# Altium project TI_kbd_pcb.PrjPcb
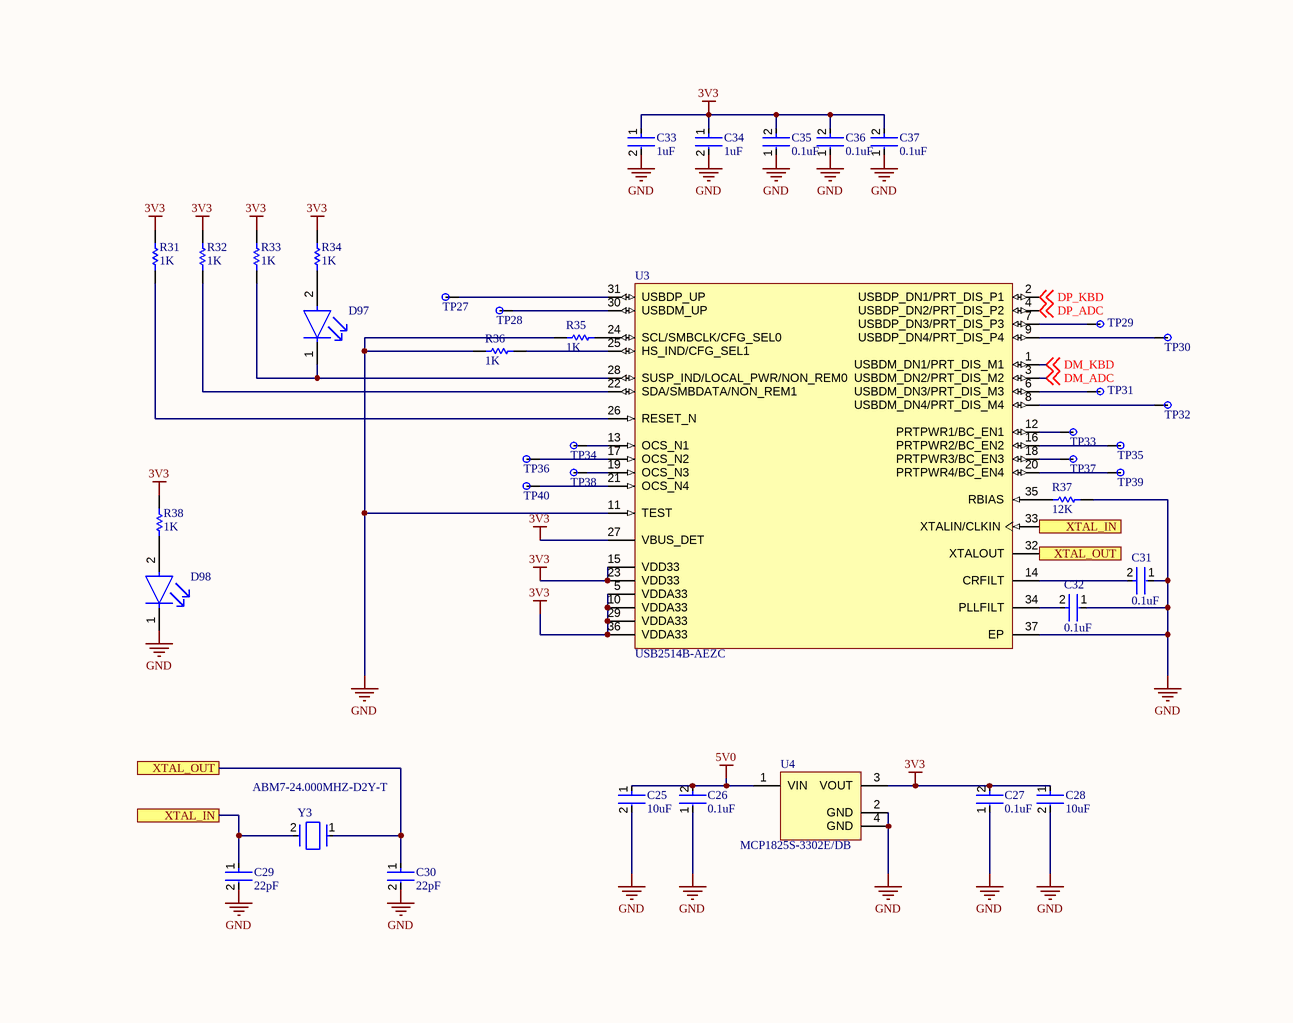
[diagram p0: TI_92_main.SchDoc]
4 sheets, 250 parts. Net scope: flat (ports and power ports of the same name join across sheets).
Board file: TI_kbd_pcb.PcbDoc
Sheets:
  TI_92_main.SchDoc
  TI_92_power.SchDoc
  TI_92_adc.SchDoc
  TI_92_kbd_ND.SchDoc

## Sheet TI_92_main.SchDoc: Keyboard
size A; Organization: Altium Limited; Address1: L3, 12a Rodborough Rd; Address2: Frenchs Forest; Address3: NSW; Address4: Australia 2086; SheetNumber: 1

### Parts
C25  10uF  [FP-0603-L_1_6_0_2-W_0_8_0-MFG]
C26  0.1uF  [FP-GRM15-MFG]
C27  0.1uF  [FP-GRM15-MFG]
C28  10uF  [FP-0603-L_1_6_0_2-W_0_8_0-MFG]
C29  22pF  [FP-0402-L_1_0_1-W_0_5_0_1-MFG]
C30  22pF  [FP-C0402C105K8PACTU-MFG]
C31  0.1uF  [FP-GRM15-MFG]
C32  0.1uF  [FP-GRM15-MFG]
C33  1uF  [FP-C0402C105K8PACTU-MFG]
C34  1uF  [FP-C0402C105K8PACTU-MFG]
C35  0.1uF  [FP-GRM15-MFG]
C36  0.1uF  [FP-GRM15-MFG]
C37  0.1uF  [FP-GRM15-MFG]
D97  APHHS1005CGCK  [FP-APHHS1005CGCK-MFG]  (value not drawn)
D98  APHHS1005CGCK  [FP-APHHS1005CGCK-MFG]  (value not drawn)
R31  1K  [RESC1005X40X25NL05T10]
R32  1K  [RESC1005X40X25NL05T10]
R33  1K  [RESC1005X40X25NL05T10]
R34  1K  [RESC1005X40X25NL05T10]
R35  1K  [RESC1005X40X25NL05T10]
R36  1K  [RESC1005X40X25NL05T10]
R37  12K  [RESC1005X40X25NL05T10]
R38  1K  [RESC1005X40X25NL05T10]
TP27  Test Pad  [2.5MM_PAD]  (value not drawn)
TP28  Test Pad  [2.5MM_PAD]  (value not drawn)
TP29  Test Pad  [2.5MM_PAD]  (value not drawn)
TP30  Test Pad  [2.5MM_PAD]  (value not drawn)
TP31  Test Pad  [2.5MM_PAD]  (value not drawn)
TP32  Test Pad  [2.5MM_PAD]  (value not drawn)
TP33  Test Pad  [1.0mm_Pad]  (value not drawn)
TP34  Test Pad  [1.0mm_Pad]  (value not drawn)
TP35  Test Pad  [1.0mm_Pad]  (value not drawn)
TP36  Test Pad  [1.0mm_Pad]  (value not drawn)
TP37  Test Pad  [1.0mm_Pad]  (value not drawn)
TP38  Test Pad  [1.0mm_Pad]  (value not drawn)
TP39  Test Pad  [1.0mm_Pad]  (value not drawn)
TP40  Test Pad  [1.0mm_Pad]  (value not drawn)
U3  USB2514B-AEZC  [MCHP-QFN-36_V]
U4  MCP1825S-3302E/DB  [SOT-223-DB3_N]
Y3  ABM7-24.000MHZ-D2Y-T  [FP-ABM7-MFG]

### Ports
XTAL_IN, XTAL_OUT

### Nets
3V3: C27.2 C28.1 C33.1 C34.1 C35.2 C36.2 C37.2 R31.2 R32.2 R33.2 R34.2 R38.2 U3.5(VDDA33) U3.10(VDDA33) U3.15(VDD33) U3.23(VDD33) U3.27(VBUS_DET) U3.29(VDDA33) U3.36(VDDA33) U4.3(VOUT)
5V0: C25.1 C26.2 U4.1(VIN)
GND: C25.2 C26.1 C27.1 C28.2 C29.2 C30.2 C31.1 C32.1 C33.2 C34.2 C35.1 C36.1 C37.1 D98.1(C) R35.2 R36.2 R37.2 U3.11(TEST) U3.37(EP) U4.2(GND) U4.4(GND)
DM_ADC: U3.3(USBDM_DN2/PRT_DIS_M2) ; off-sheet DM_ADC
DM_KBD: U3.1(USBDM_DN1/PRT_DIS_M1) ; off-sheet DM_KBD
DP_ADC: U3.4(USBDP_DN2/PRT_DIS_P2) ; off-sheet DP_ADC
DP_KBD: U3.2(USBDP_DN1/PRT_DIS_P1) ; off-sheet DP_KBD
NetC29_1: C29.1 U3.33(XTALIN/CLKIN) Y3.2 ; port XTAL_IN
NetC30_1: C30.1 U3.32(XTALOUT) Y3.1 ; port XTAL_OUT
NetC31_2: C31.2 U3.14(CRFILT)
NetC32_2: C32.2 U3.34(PLLFILT)
NetD97_1: D97.1(C) R33.1 U3.28(SUSP_IND/LOCAL_PWR/NON_REM0)
NetD97_2: D97.2(A) R34.1
NetD98_2: D98.2(A) R38.1
NetR31_1: R31.1 U3.26(RESET_N)
NetR32_1: R32.1 U3.22(SDA/SMBDATA/NON_REM1)
NetR35_1: R35.1 U3.24(SCL/SMBCLK/CFG_SEL0)
NetR36_1: R36.1 U3.25(HS_IND/CFG_SEL1)
NetR37_1: R37.1 U3.35(RBIAS)
NetTP27_1: TP27.1(PAD) U3.31(USBDP_UP)
NetTP28_1: TP28.1(PAD) U3.30(USBDM_UP)
NetTP29_1: TP29.1(PAD) U3.7(USBDP_DN3/PRT_DIS_P3)
NetTP30_1: TP30.1(PAD) U3.9(USBDP_DN4/PRT_DIS_P4)
NetTP31_1: TP31.1(PAD) U3.6(USBDM_DN3/PRT_DIS_M3)
NetTP32_1: TP32.1(PAD) U3.8(USBDM_DN4/PRT_DIS_M4)
NetTP33_1: TP33.1(PAD) U3.12(PRTPWR1/BC_EN1)
NetTP34_1: TP34.1(PAD) U3.13(OCS_N1)
NetTP35_1: TP35.1(PAD) U3.16(PRTPWR2/BC_EN2)
NetTP36_1: TP36.1(PAD) U3.17(OCS_N2)
NetTP37_1: TP37.1(PAD) U3.18(PRTPWR3/BC_EN3)
NetTP38_1: TP38.1(PAD) U3.19(OCS_N3)
NetTP39_1: TP39.1(PAD) U3.20(PRTPWR4/BC_EN4)
NetTP40_1: TP40.1(PAD) U3.21(OCS_N4)

### Notes on the sheet
- DWG. NO.
- REV.
- SHT.
- THIS DOCUMENT AND THE DATA DISCLOSED HEREIN OR HEREWITH IS THE PROPERTY OF ALTIUM LIMITED AND MAY BE FREELY DISTRIBUTED IN WHOLE. NO RIGHTS ARE RESERVED OR EXPRESS OR IMPLIED WARANTEE GIVEN.
- REVISION
- DESCRIPTION
- DATE
- APPROVED
- ENG:
- APPROVALS
- PROJECT
- DSN:
- CHK:
- REFERENCE DOCUMENTS
- PROJECT REVISION:
- TITLE
- DOCUMENT REVISION:
- DESIGN ITEM:
- BOM:
- FAB DWG:
- PCB DWG:
- ASSY DWG:
- SCALE:
- SIZE
- B
- CAGE CODE
- FILE NAME
- DWG NO.
- SHEET
- OF
- REV

### Library data of the parts
C25 C28 = CMP-14477-005164-2: Multilayer Ceramic Capacitor 10uF 25V X5R 20% SMD 0603 T/R; Capacitance: 10uF; Packaging: Tape and Reel; Tolerance: 20%; Mount: Surface Mount; Case Code (Metric): 1608; Case Code (Imperial): 0603; Min Operating Temperature: -55°C; Lead Free: Lead Free; RoHS Compliant: Yes; Case/Package: 0603; Max Operating Temperature: 85°C; Voltage Rating: 25V
C26 C27 C31 C32 C35-C37 = CMP-2100-03641-2: CAP CER 0.1UF 16V X7R 0402; Manufacturer Part Number: GRM155R71C104KA88D; Manufacturer: Murata; Standoff Height: 0mm; Tolerance: 10%; Voltage Rating: 16Vdc; Material: Ceramic; Capacitance: 0.10μF; Value: 0.10μF; RoHS: TRUE; Temperature Characteristic: X7R; Octopart: https://octopart.com/grm155r71c104ka88d-murata-196880; Digikey Description: CAP CER 0.1UF 16V X7R 0402; Device Class L3: Ceramic Capacitors; Height: 0.55mm; ComponentLink2Description: Datasheet; Temperature Range Low: -55°C; Ipc Land Pattern Name: CAPC10050X219; ComponentLink2URL: https://search.murata.co.jp/Ceramy/image/img/A01X/G101/ENG/GRM155R71H471KA01-01A.pdf; Device Class L1: Passive Components; Lead Free: yes; Category: Cap; Package: GRM15; Temperature: -55°C to +125°C; Device Class L2: Capacitors; Temperature Range High: +125°C; Mouser Description: 0402 0.1 uF 16V ±10 % Tolerance X7R SMT Multilayer Ceramic Capacitor
C29 = CMP-2008-02613-2: General Purpose Ceramic Capacitor, 0402, 22pF, 5%, C0G, 30ppm/°C, 50V; Temperature Coefficient: 30ppm/°C; Mount: Surface Mount; Length: 1mm; Construction: Flat; Contact Plating: Tin; REACH SVHC: No SVHC; Case/Package: 0402; Voltage: 50V; Case Code (Imperial): 0402; Thickness: 0.022inch; Radiation Hardening: No; Number of Pins: 2; Tolerance: 5%; Max Operating Temperature: 125°C; RoHS Compliant: Yes; Voltage Rating: 50V; Case Code (Metric): 1005; Package Quantity: 1; Width: 0.02inch; Termination: SMD/SMT; Lead Free: Lead Free; Height: 0.5mm; Voltage Rating (DC): 50V; Capacitance: 22pF; Min Operating Temperature: -55°C; Series: -; Depth: 0.5mm; Dielectric: C0G; Packaging: Tape and Reel
C30 C33 C34 = CMP-2008-02081-2: CAP CER 1UF 10V X5R 0402; Dielectric Material: Ceramic; Dissipation Factor: 5%; Tolerance: 10%; Number of Pins: 2; Contact Plating: Tin; Min Operating Temperature: -55°C; Termination: SMD/SMT; Lead Free: Lead Free; Construction: Flat; Voltage Rating (DC): 10V; Mount: Surface Mount; Series: C; Thickness: 0.022inch; Width: 0.5mm; Radiation Hardening: No; Capacitance: 1uF; Dielectric: X5R; Height: 0.5mm; Voltage: 10V; Length: 1mm; Depth: 0.5mm; Max Operating Temperature: 85°C; Package Quantity: 1; Packaging: Tape and Reel; RoHS Compliant: Yes; Case Code (Imperial): 0402; Case Code (Metric): 1005; REACH SVHC: No SVHC; Voltage Rating: 10V; Case/Package: 0402
D97 D98 = CMP-44529-000044-1: LED GREEN CLEAR CHIP SMD; Viewing Angle: 120°; Dominant Wavelength: 570nm; Test Current: 20mA; Luminous Intensity: 50mcd; Forward Voltage: 2.1V; Number of LEDs: 1; Lens Color: Clear; Packaging: Tape and Reel; Max Operating Temperature: 85°C; Illumination Color: Green; Length: 1mm; Mount: Surface Mount; Lens Style: Clear; Color: Green; Number of Pins: 2; Wavelength: 570nm; Case/Package: 0402; Width: 0.5mm; Package Quantity: 2000; Case Code (Metric): 1005; Height: 0.6mm; Lead Free: Lead Free; Case Code (Imperial): 0402; Forward Current: 20mA; Min Operating Temperature: -40°C
R31-R38 = CMP-2002-07472-1: Part Number: RC0402FR-071KL; Manufacturer: Yageo / Phycomp
TP27-TP40 = Test_Pad: Various Test Pads
U3 = CMP-2000-05217-1: USB 2.0 High-Speed Hub Controller, 4 Ports, 3 to 3.6 V, 0 to 85 degC, 36-Pin QFN, RoHS, Tray; Manufacturer: Microchip; Interface: I²CEEPROM,SMBus(2-Wire,I²C); Other Names: 638-1122; Voltage - Supply: 3V~3.6V; Current - Supply: 70mA; Manufacturer URL: http://www.microchip.com/; Packaging: Tray; Function: -; Standards: -; Category: IntegratedCircuits(ICs); Package / Case: 36-VFQFNExposedPad; Supplier Device Package: 36-QFN(6x6); Family: Interface-Controllers; Datasheet Version: DS00001692C, 10/2015; Standard Package: 490; Series: -; Protocol: -; Datasheet URL: http://ww1.microchip.com/downloads/en/DeviceDoc/00001692C.pdf; Operating Temperature: -
U4 = CMP-0136-00458-1: 500 mA, Low Voltage, Low Quiescent Current LDO Regulator, 3-Pin SOT-223, Extended Temperature; PackageReference: SOT-223-DB3; PackageDescription: 3-Lead Plastic Small Outline Transistor (DB) [SOT-223]; PackageVersion: revBB, Aug-2009; DatasheetVersion: revB, Feb-2008
Y3 = CMP-27762-000095-1: Crystal 16MHz ±20ppm 18pF SMD-2 6mm x 3.5mm; ESR (Equivalent Series Resistance): 50R; Frequency Stability: 30ppm; Width: 3.3mm; Frequency: 16MHz; Radiation Hardening: No; Height: 0.055inch; Tolerance: 20ppm; Length: 6mm; Case/Package: CSMD; Lead Free: Lead Free; Min Operating Temperature: -40°C; Termination: SMD/SMT; Operating Frequency: 16 MHz; Resistor Type: Ceramic; Packaging: Tape and Reel; Mount: Surface Mount; Load Capacitance: 18pF; Frequency Tolerance: 20ppm; Depth: 3.5mm; Series: ABM7; Package Quantity: 1000; Max Operating Temperature: 85°C; Number of Pins: 2

## Sheet TI_92_power.SchDoc: Power
size A; Organization: Altium Limited; Address1: L3, 12a Rodborough Rd; Address2: Frenchs Forest; Address3: NSW; Address4: Australia 2086; SheetNumber: 2
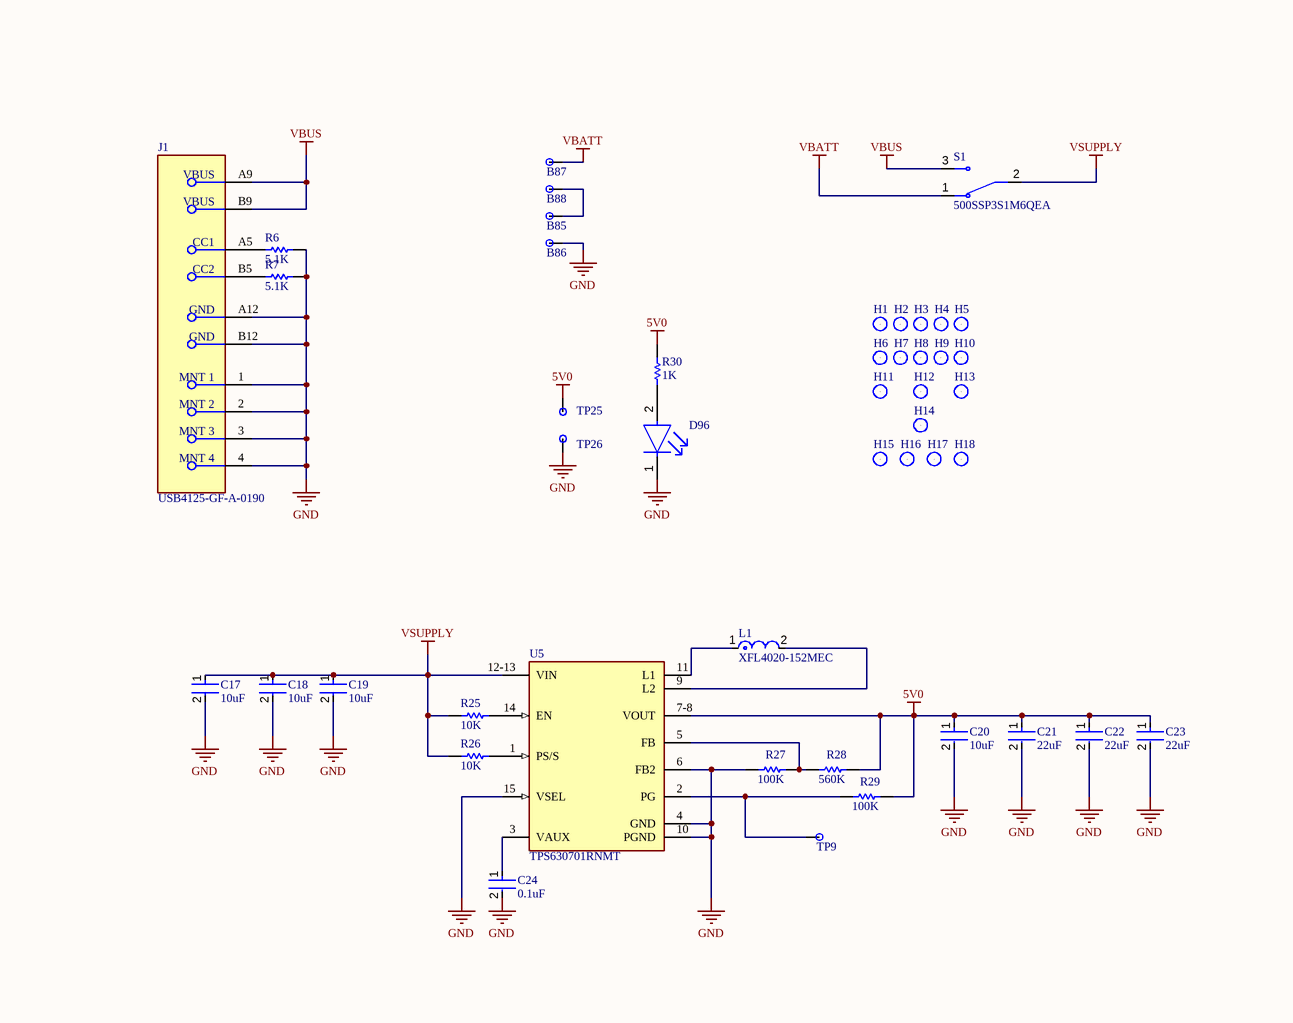
[diagram p1: TI_92_power.SchDoc]

### Parts
B85  Test Pad  [10mm_x_10mm_PAD]  (value not drawn)
B86  Test Pad  [10mm_x_8mm_PAD]  (value not drawn)
B87  Test Pad  [10mm_x_10mm_PAD]  (value not drawn)
B88  Test Pad  [10mm_x_8mm_PAD]  (value not drawn)
C17  10uF  [FP-GRM21B-0_2-e0_2_0_7-IPC_A]
C18  10uF  [FP-GRM21B-0_2-e0_2_0_7-IPC_A]
C19  10uF  [FP-0603-L_1_6_0_2-W_0_8_0-MFG]
C20  10uF  [FP-0603-L_1_6_0_2-W_0_8_0-MFG]
C21  22uF  [FP-GRM21B-0_2-e0_2_0_7-MFG]
C22  22uF  [FP-GRM21B-0_2-e0_2_0_7-MFG]
C23  22uF  [FP-GRM21B-0_2-e0_2_0_7-MFG]
C24  0.1uF  [FP-0402-L_1_0_0_05-W_0_5-IPC_B]
D96  APHHS1005CGCK  [FP-APHHS1005CGCK-MFG]  (value not drawn)
H1  Mounting Hole  [2.7mm_HOLE]  (value not drawn)
H2  Mounting Hole  [2.7mm_HOLE]  (value not drawn)
H3  Mounting Hole  [1.5mm_hole]  (value not drawn)
H4  Mounting Hole  [2.7mm_HOLE]  (value not drawn)
H5  Mounting Hole  [2.7mm_HOLE]  (value not drawn)
H6  Mounting Hole  [2.7mm_HOLE]  (value not drawn)
H7  Mounting Hole  [2.7mm_HOLE]  (value not drawn)
H8  Mounting Hole  [2.7mm_HOLE]  (value not drawn)
H9  Mounting Hole  [2.7mm_HOLE]  (value not drawn)
H10  Mounting Hole  [2.7mm_HOLE]  (value not drawn)
H11  Mounting Hole  [2.4mm_HOLE]  (value not drawn)
H12  Mounting Hole  [2.4mm_HOLE]  (value not drawn)
H13  Mounting Hole  [2.4mm_HOLE]  (value not drawn)
H14  Mounting Hole  [1.5mm_hole]  (value not drawn)
H15  Mounting Hole  [3.1mm_HOLE]  (value not drawn)
H16  Mounting Hole  [3.1mm_HOLE]  (value not drawn)
H17  Mounting Hole  [3.1mm_HOLE]  (value not drawn)
H18  Mounting Hole  [3.1mm_HOLE]  (value not drawn)
J1  USB4125-GF-A-0190  [FP-USB4125-GF-A-0190-MFG]
L1  XFL4020-152MEC  [FP-XFL4020-MFG]
R6  5.1K  [RESC1005X40X25NL05T10]
R7  5.1K  [RESC1005X40X25NL05T10]
R25  10K  [RESC1005X40X25NL05T10]
R26  10K  [RESC1005X40X25NL05T10]
R27  100K  [RESC1005X40X25NL05T10]
R28  560K  [RESC1005X40X25NL05T10]
R29  100K  [RESC1005X40X25NL05T10]
R30  1K  [RESC1005X40X25NL05T10]
S1  500SSP3S1M6QEA  [SW_500SSP3S1M6QEA]
TP9  Test Pad  [1.5MM_PAD]  (value not drawn)
TP25  Test Pad  [2.5MM_PAD]  (value not drawn)
TP26  Test Pad  [2.5MM_PAD]  (value not drawn)
U5  TPS630701RNMT  [FP-RNM0015A-MFG]

### Nets
5V0: C20.1 C21.1 C22.1 C23.1 R28.2 R29.2 R30.2 TP25.1(PAD) U5.7-8(VOUT)
GND: B86.1(PAD) C17.2 C18.2 C19.2 C20.2 C21.2 C22.2 C23.2 C24.2 D96.1(C) J1.1(MNT_1) J1.2(MNT_2) J1.3(MNT_3) J1.4(MNT_4) J1.A12(GND) J1.B12(GND) R6.1 R7.1 R27.1 TP26.1(PAD) U5.4(GND) U5.6(FB2) U5.10(PGND) U5.15(VSEL)
VBATT: B87.1(PAD) S1.1(NC)
VBUS: J1.A9(VBUS) J1.B9(VBUS) S1.3(NO)
VSUPPLY: C17.1 C18.1 C19.1 R25.2 R26.2 S1.2(COM) U5.12-13(VIN)
NetB85_1: B85.1(PAD) B88.1(PAD)
NetC24_1: C24.1 U5.3(VAUX)
NetD96_2: D96.2(A) R30.1
NetJ1_A5: J1.A5(CC1) R6.2
NetJ1_B5: J1.B5(CC2) R7.2
NetL1_1: L1.1 U5.11(L1)
NetL1_2: L1.2 U5.9(L2)
NetR25_1: R25.1 U5.14(EN)
NetR26_1: R26.1 U5.1(PS/S)
NetR27_2: R27.2 R28.1 U5.5(FB)
NetR29_1: R29.1 TP9.1(PAD) U5.2(PG)

Not connected (* = marked no-connect by the designer): H1 1(HOLE); H2 1(HOLE); H3 1(HOLE); H4 1(HOLE); H5 1(HOLE); H6 1(HOLE); H7 1(HOLE); H8 1(HOLE); H9 1(HOLE); H10 1(HOLE); H11 1(HOLE); H12 1(HOLE); H13 1(HOLE); H14 1(HOLE); H15 1(HOLE); H16 1(HOLE); H17 1(HOLE); H18 1(HOLE)

### Notes on the sheet
- DWG. NO.
- REV.
- SHT.
- THIS DOCUMENT AND THE DATA DISCLOSED HEREIN OR HEREWITH IS THE PROPERTY OF ALTIUM LIMITED AND MAY BE FREELY DISTRIBUTED IN WHOLE. NO RIGHTS ARE RESERVED OR EXPRESS OR IMPLIED WARANTEE GIVEN.
- REVISION
- DESCRIPTION
- DATE
- APPROVED
- ENG:
- APPROVALS
- PROJECT
- DSN:
- CHK:
- REFERENCE DOCUMENTS
- PROJECT REVISION:
- TITLE
- DOCUMENT REVISION:
- DESIGN ITEM:
- BOM:
- FAB DWG:
- PCB DWG:
- ASSY DWG:
- SCALE:
- SIZE
- B
- CAGE CODE
- FILE NAME
- DWG NO.
- SHEET
- OF
- REV

### Library data of the parts
B85-B88 TP9 TP25 TP26 = Test_Pad: Various Test Pads
C17 C18 = CMP-06035-056773-1: Chip Multilayer Ceramic Capacitors for General Purpose, 0805, 10uF, X7S, 22%, 20%, 25V; Case/Package: 0805; Min Operating Temperature: -55°C; Packaging: Tape and Reel; Height: 1.25mm; Thickness: 0.057inch; Weight: 0.000335oz; Termination: SMD/SMT; Capacitance: 10uF; Max Operating Temperature: 125°C; Length: 0.079inch; Dielectric: X7S; Mount: Surface Mount; Voltage Rating (DC): 25V; Case Code (Imperial): 0805; Case Code (Metric): 2012; Voltage Rating: 25V; Tolerance: 20%; Package Quantity: 3000; Width: 0.049inch
C19 C20 = CMP-14477-005164-2: as C25 on sheet TI_92_main; Capacitance: 10uF; Packaging: Tape and Reel; Tolerance: 20%; Mount: Surface Mount; Case Code (Metric): 1608; Case Code (Imperial): 0603; Min Operating Temperature: -55°C; Lead Free: Lead Free; RoHS Compliant: Yes; Case/Package: 0603; Max Operating Temperature: 85°C; Voltage Rating: 25V
C21-C23 = CMP-06035-012913-1: Chip Multilayer Ceramic Capacitors for General Purpose, 0805, 22uF, X6S, 22%, 20%, 16V; Packaging: Tape and Reel; Dielectric: X6S; Case Code (Imperial): 0805; Weight: 0.000335oz; Case Code (Metric): 2012; Thickness: 0.057inch; Min Operating Temperature: -55°C; Voltage Rating (DC): 16V; Tolerance: 20%; Width: 1.25mm; Voltage Rating: 16V; Mount: Surface Mount; Capacitance: 22uF; Length: 0.079inch; Lead Free: Lead Free; Case/Package: 0805; Package Quantity: 3000; Height: 1.25mm; Max Operating Temperature: 105°C; Termination: SMD/SMT
C24 = CMP-14477-003834-2: None; Capacitance: 100nF; Voltage Rating: 25V; Tolerance: 20%; Min Operating Temperature: -55°C; Max Operating Temperature: 125°C; Mount: Surface Mount; RoHS Compliant: Yes; Case/Package: 0402; Packaging: Tape and Reel
D96 = CMP-44529-000044-1: as D97 on sheet TI_92_main; Lens Color: Clear; Packaging: Tape and Reel; Max Operating Temperature: 85°C; Illumination Color: Green; Length: 1mm; Mount: Surface Mount; Lens Style: Clear; Color: Green; Number of Pins: 2; Wavelength: 570nm; Case/Package: 0402; Width: 0.5mm; Package Quantity: 2000; Case Code (Metric): 1005; Height: 0.6mm; Lead Free: Lead Free; Case Code (Imperial): 0402; Forward Current: 20mA; Min Operating Temperature: -40°C
H1-H18 = Mounting_Hole: Various Mounting Holes
J1 = CMP-245163-000004-1: CONN RCPT TYPE C 6P SMD RA
L1 = CMP-11268-000104-1: Inductor Power Shielded Wirewound 1.5uH 20% 100KHz 9.1A 15.8mOhm DCR 1515 Automotive Embossed Plastic T/R; Core Material: Composite; DC Resistance (DCR): 15.8mR; Saturation Current: 4.1A; Self Resonant Frequency: 59MHz; Tolerance: 20%; Inductance: 1.5uH; Max DC Current: 9.1A; RoHS Compliant: Yes; Max Operating Temperature: 125°C; Length: 4.3mm; Case/Package: SMD/SMT; Mount: Surface Mount; Shielding: Shielded; Min Operating Temperature: -40°C; RMS Current (Irms): 9.1A; Test Frequency: 100kHz; Inductance Tolerance: 20%; REACH SVHC: No SVHC; Packaging: Tape and Reel; Termination: SMD/SMT; Lead Free: Contains Lead; Width: 4.3mm; Series: XFL4020; Height: 2.1mm
R6 R7 R25-R30 = CMP-2002-07472-1: as R31 on sheet TI_92_main
U5 = CMP-04918-000497-1: IC REG BCK BST 5V 2A 15VQFN; Max Input Voltage: 16V; Switching Frequency: 2.4MHz; Min Input Voltage: 2V; Quiescent Current: 50uA; Topology: Buck-Boost; Output Current: 2A; Number of Pins: 15; Max Operating Temperature: 125°C; Packaging: Cut Tape; Nominal Output Voltage: 5V; REACH SVHC: No SVHC; RoHS Compliant: Yes; Lead Free: Lead Free
S1 = 500SSP3S1M6QEA: Price: None; MP: 500SSP3S1M6QEA; Availability: Unavailable; Value: *; Package: None

## Sheet TI_92_adc.SchDoc: Data_Input
size B; Organization: Altium Limited; Address1: L3, 12a Rodborough Rd; Address2: Frenchs Forest; Address3: NSW; Address4: Australia 2086; SheetNumber: 3
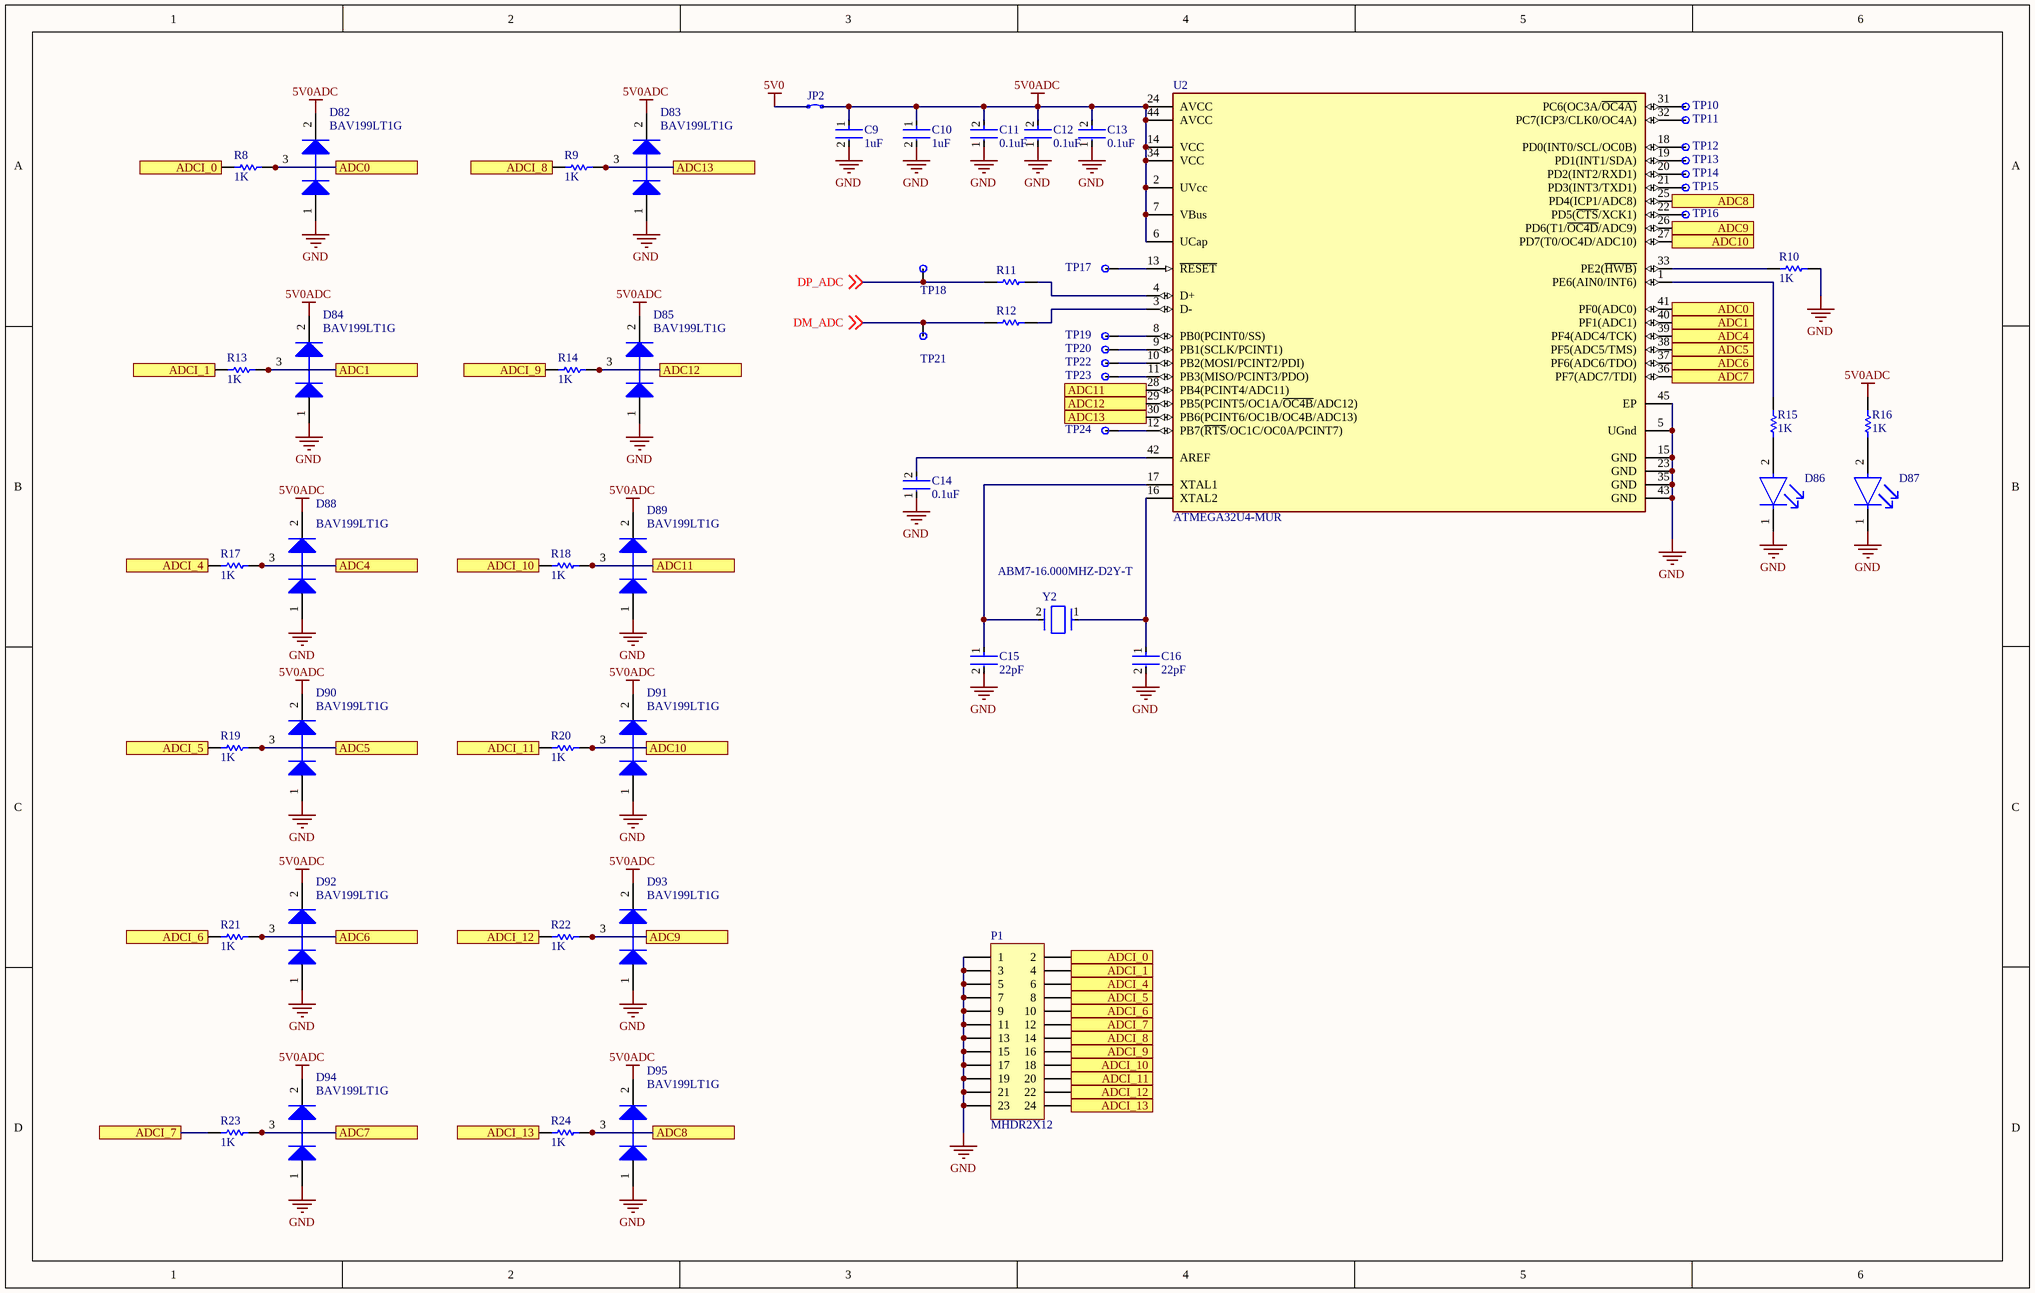
[diagram p2: TI_92_adc.SchDoc]

### Parts
C9  1uF  [FP-C0402C105K8PACTU-MFG]
C10  1uF  [FP-C0402C105K8PACTU-MFG]
C11  0.1uF  [FP-GRM15-MFG]
C12  0.1uF  [FP-GRM15-MFG]
C13  0.1uF  [FP-GRM15-MFG]
C14  0.1uF  [FP-GRM15-MFG]
C15  22pF  [FP-0402-L_1_0_1-W_0_5_0_1-MFG]
C16  22pF  [FP-C0402C105K8PACTU-MFG]
D82  BAV199LT1G  [ONSC-SOT-23-3-318-08_V]
D83  BAV199LT1G  [ONSC-SOT-23-3-318-08_V]
D84  BAV199LT1G  [ONSC-SOT-23-3-318-08_V]
D85  BAV199LT1G  [ONSC-SOT-23-3-318-08_V]
D86  APHHS1005CGCK  [FP-APHHS1005CGCK-MFG]  (value not drawn)
D87  APHHS1005CGCK  [FP-APHHS1005CGCK-MFG]  (value not drawn)
D88  BAV199LT1G  [ONSC-SOT-23-3-318-08_V]
D89  BAV199LT1G  [ONSC-SOT-23-3-318-08_V]
D90  BAV199LT1G  [ONSC-SOT-23-3-318-08_V]
D91  BAV199LT1G  [ONSC-SOT-23-3-318-08_V]
D92  BAV199LT1G  [ONSC-SOT-23-3-318-08_V]
D93  BAV199LT1G  [ONSC-SOT-23-3-318-08_V]
D94  BAV199LT1G  [ONSC-SOT-23-3-318-08_V]
D95  BAV199LT1G  [ONSC-SOT-23-3-318-08_V]
JP2  Solder Jumper  [SOLDER_JUMPER_CLOSED]  (value not drawn)
P1  MHDR2X12  [24_pin_Right_Angle_SMT_Header]
R8  1K  [RESC1005X40X25NL05T10]
R9  1K  [RESC1005X40X25NL05T10]
R10  1K  [RESC1005X40X25LL05T05]
R11  CRCW040222R0FKED  [RESC1005X40X25LL05T05]  (value not drawn)
R12  CRCW040222R0FKED  [RESC1005X40X25LL05T05]  (value not drawn)
R13  1K  [RESC1005X40X25NL05T10]
R14  1K  [RESC1005X40X25NL05T10]
R15  1K  [RESC1005X40X25NL05T10]
R16  1K  [RESC1005X40X25NL05T10]
R17  1K  [RESC1005X40X25NL05T10]
R18  1K  [RESC1005X40X25NL05T10]
R19  1K  [RESC1005X40X25NL05T10]
R20  1K  [RESC1005X40X25NL05T10]
R21  1K  [RESC1005X40X25NL05T10]
R22  1K  [RESC1005X40X25NL05T10]
R23  1K  [RESC1005X40X25NL05T10]
R24  1K  [RESC1005X40X25NL05T10]
TP10  Test Pad  [1.0mm_Pad]  (value not drawn)
TP11  Test Pad  [1.0mm_Pad]  (value not drawn)
TP12  Test Pad  [1.5MM_PAD]  (value not drawn)
TP13  Test Pad  [1.5MM_PAD]  (value not drawn)
TP14  Test Pad  [1.5MM_PAD]  (value not drawn)
TP15  Test Pad  [1.5MM_PAD]  (value not drawn)
TP16  Test Pad  [1.5MM_PAD]  (value not drawn)
TP17  Test Pad  [1.5MM_PAD]  (value not drawn)
TP18  Test Pad  [1.5MM_PAD]  (value not drawn)
TP19  Test Pad  [1.5MM_PAD]  (value not drawn)
TP20  Test Pad  [1.5MM_PAD]  (value not drawn)
TP21  Test Pad  [1.5MM_PAD]  (value not drawn)
TP22  Test Pad  [1.5MM_PAD]  (value not drawn)
TP23  Test Pad  [1.5MM_PAD]  (value not drawn)
TP24  Test Pad  [1.5MM_PAD]  (value not drawn)
U2  ATMEGA32U4-MUR  [FP-44PW-MFG]
Y2  ABM7-16.000MHZ-D2Y-T  [FP-ABM7-MFG]

### Ports
ADC0, ADC1, ADC4, ADC5, ADC6, ADC7, ADC8, ADC9, ADC10, ADC11, ADC12, ADC13, ADCI_0, ADCI_1, ADCI_4, ADCI_5, ADCI_6, ADCI_7, ADCI_8, ADCI_9, ADCI_10, ADCI_11, ADCI_12, ADCI_13

### Nets
5V0: JP2.1
5V0ADC: C9.1 C10.1 C11.2 C12.2 C13.2 D82.2(K) D83.2(K) D84.2(K) D85.2(K) D88.2(K) D89.2(K) D90.2(K) D91.2(K) D92.2(K) D93.2(K) D94.2(K) D95.2(K) JP2.2 R16.2 U2.2(UVcc) U2.6(UCap) U2.7(VBus) U2.14(VCC) U2.24(AVCC) U2.34(VCC) U2.44(AVCC)
GND: C9.2 C10.2 C11.1 C12.1 C13.1 C14.1 C15.2 C16.2 D82.1(A) D83.1(A) D84.1(A) D85.1(A) D86.1(C) D87.1(C) D88.1(A) D89.1(A) D90.1(A) D91.1(A) D92.1(A) D93.1(A) D94.1(A) D95.1(A) P1.1 P1.3 P1.5 P1.7 P1.9 P1.11 P1.13 P1.15 P1.17 P1.19 P1.21 P1.23 R10.2 U2.5(UGnd) U2.15(GND) U2.23(GND) U2.35(GND) U2.43(GND) U2.45(EP)
DM_ADC: R12.1 TP21.1(PAD) ; off-sheet DM_ADC
DP_ADC: R11.1 TP18.1(PAD) ; off-sheet DP_ADC
NetC14_2: C14.2 U2.42(AREF)
NetC15_1: C15.1 U2.17(XTAL1) Y2.2
NetC16_1: C16.1 U2.16(XTAL2) Y2.1
NetD82_3: D82.3(K/A) R8.1 U2.41(PF0(ADC0)) ; port ADC0
NetD83_3: D83.3(K/A) R9.1 U2.30(PB6(PCINT6/OC1B/OC4B/ADC13)) ; port ADC13
NetD84_3: D84.3(K/A) R13.1 U2.40(PF1(ADC1)) ; port ADC1
NetD85_3: D85.3(K/A) R14.1 U2.29(PB5(PCINT5/OC1A/~{OC4B}/ADC12)) ; port ADC12
NetD86_2: D86.2(A) R15.1
NetD87_2: D87.2(A) R16.1
NetD88_3: D88.3(K/A) R17.1 U2.39(PF4(ADC4/TCK)) ; port ADC4
NetD89_3: D89.3(K/A) R18.1 U2.28(PB4(PCINT4/ADC11)) ; port ADC11
NetD90_3: D90.3(K/A) R19.1 U2.38(PF5(ADC5/TMS)) ; port ADC5
NetD91_3: D91.3(K/A) R20.1 U2.27(PD7(T0/OC4D/ADC10)) ; port ADC10
NetD92_3: D92.3(K/A) R21.1 U2.37(PF6(ADC6/TDO)) ; port ADC6
NetD93_3: D93.3(K/A) R22.1 U2.26(PD6(T1/~{OC4D}/ADC9)) ; port ADC9
NetD94_3: D94.3(K/A) R23.1 U2.36(PF7(ADC7/TDI)) ; port ADC7
NetD95_3: D95.3(K/A) R24.1 U2.25(PD4(ICP1/ADC8)) ; port ADC8
NetP1_2: P1.2 R8.2 ; port ADCI_0
NetP1_4: P1.4 R13.2 ; port ADCI_1
NetP1_6: P1.6 R17.2 ; port ADCI_4
NetP1_8: P1.8 R19.2 ; port ADCI_5
NetP1_10: P1.10 R21.2 ; port ADCI_6
NetP1_12: P1.12 R23.2 ; port ADCI_7
NetP1_14: P1.14 R9.2 ; port ADCI_8
NetP1_16: P1.16 R14.2 ; port ADCI_9
NetP1_18: P1.18 R18.2 ; port ADCI_10
NetP1_20: P1.20 R20.2 ; port ADCI_11
NetP1_22: P1.22 R22.2 ; port ADCI_12
NetP1_24: P1.24 R24.2 ; port ADCI_13
NetR10_1: R10.1 U2.33(PE2(~{HWB)})
NetR11_2: R11.2 U2.4(D+)
NetR12_2: R12.2 U2.3(D-)
NetR15_2: R15.2 U2.1(PE6(AIN0/INT6))
NetTP10_1: TP10.1(PAD) U2.31(PC6(OC3A/~{OC4A)})
NetTP11_1: TP11.1(PAD) U2.32(PC7(ICP3/CLK0/OC4A))
NetTP12_1: TP12.1(PAD) U2.18(PD0(INT0/SCL/OC0B))
NetTP13_1: TP13.1(PAD) U2.19(PD1(INT1/SDA))
NetTP14_1: TP14.1(PAD) U2.20(PD2(INT2/RXD1))
NetTP15_1: TP15.1(PAD) U2.21(PD3(INT3/TXD1))
NetTP16_1: TP16.1(PAD) U2.22(PD5(~{CTS}/XCK1))
NetTP17_1: TP17.1(PAD) U2.13(~{RESET})
NetTP19_1: TP19.1(PAD) U2.8(PB0(PCINT0/SS))
NetTP20_1: TP20.1(PAD) U2.9(PB1(SCLK/PCINT1))
NetTP22_1: TP22.1(PAD) U2.10(PB2(MOSI/PCINT2/PDI))
NetTP23_1: TP23.1(PAD) U2.11(PB3(MISO/PCINT3/PDO))
NetTP24_1: TP24.1(PAD) U2.12(PB7(~{RTS}/OC1C/OC0A/PCINT7))

### Notes on the sheet
- Title
- Size:
- Date:
- File:
- C
- Number:
- Time:
- Revision:
- Sheet
- of

### Library data of the parts
C9 C10 C16 = CMP-2008-02081-2: as C30 on sheet TI_92_main; Number of Pins: 2; Contact Plating: Tin; Min Operating Temperature: -55°C; Termination: SMD/SMT; Lead Free: Lead Free; Construction: Flat; Voltage Rating (DC): 10V; Mount: Surface Mount; Series: C; Thickness: 0.022inch; Width: 0.5mm; Radiation Hardening: No; Capacitance: 1uF; Dielectric: X5R; Height: 0.5mm; Voltage: 10V; Length: 1mm; Depth: 0.5mm; Max Operating Temperature: 85°C; Package Quantity: 1; Packaging: Tape and Reel; RoHS Compliant: Yes; Case Code (Imperial): 0402; Case Code (Metric): 1005; REACH SVHC: No SVHC; Voltage Rating: 10V; Case/Package: 0402
C11-C14 = CMP-2100-03641-2: as C26 on sheet TI_92_main; RoHS: TRUE; Temperature Characteristic: X7R; Octopart: https://octopart.com/grm155r71c104ka88d-murata-196880; Digikey Description: CAP CER 0.1UF 16V X7R 0402; Device Class L3: Ceramic Capacitors; Height: 0.55mm; ComponentLink2Description: Datasheet; Temperature Range Low: -55°C; Ipc Land Pattern Name: CAPC10050X219; ComponentLink2URL: https://search.murata.co.jp/Ceramy/image/img/A01X/G101/ENG/GRM155R71H471KA01-01A.pdf; Device Class L1: Passive Components; Lead Free: yes; Category: Cap; Package: GRM15; Temperature: -55°C to +125°C; Device Class L2: Capacitors; Temperature Range High: +125°C; Mouser Description: 0402 0.1 uF 16V ±10 % Tolerance X7R SMT Multilayer Ceramic Capacitor
C15 = CMP-2008-02613-2: as C29 on sheet TI_92_main; Temperature Coefficient: 30ppm/°C; Mount: Surface Mount; Length: 1mm; Construction: Flat; Contact Plating: Tin; REACH SVHC: No SVHC; Case/Package: 0402; Voltage: 50V; Case Code (Imperial): 0402; Thickness: 0.022inch; Radiation Hardening: No; Number of Pins: 2; Tolerance: 5%; Max Operating Temperature: 125°C; RoHS Compliant: Yes; Voltage Rating: 50V; Case Code (Metric): 1005; Package Quantity: 1; Width: 0.02inch; Termination: SMD/SMT; Lead Free: Lead Free; Height: 0.5mm; Voltage Rating (DC): 50V; Capacitance: 22pF; Min Operating Temperature: -55°C; Series: -; Depth: 0.5mm; Dielectric: C0G; Packaging: Tape and Reel
D82-D85 D88-D95 = CMP-1054-00087-1: Dual Series Switching Diodes, 3-Pin SOT-23, Pb-Free, Tape and Reel; Manufacturer: On Semiconductor; IF Max (A): 0.215; trr Max (ns): 3000; PartNumber: BAV199LT1G; RoHS: TRUE; ComponentLink1Description: Manufacturer URL; ComponentLink2URL: http://www.onsemi.com/pub_link/Collateral/BAV199LT1-D.PDF; Mounting Technology: Surface Mount; ComponentLink2Description: Datasheet; ComponentLink3Description: Package Specification; PackageReference: SOT-23-3-318-08; PackageVersion: Rev. AP, 11/2009; Packing: Tape and Reel; DatasheetVersion: Rev. 8; Configuration: Dual Series; ComponentLink1URL: http://www.onsemi.com/; ComponentLink3URL: http://www.onsemi.cn/pub_link/Collateral/318-08.PDF; PackageDescription: 3-Pin Small Outline Transistor, Body 2.92 x 1.3 mm, Pitch 0.95 mm
D86 D87 = CMP-44529-000044-1: as D97 on sheet TI_92_main; Lens Color: Clear; Packaging: Tape and Reel; Max Operating Temperature: 85°C; Illumination Color: Green; Length: 1mm; Mount: Surface Mount; Lens Style: Clear; Color: Green; Number of Pins: 2; Wavelength: 570nm; Case/Package: 0402; Width: 0.5mm; Package Quantity: 2000; Case Code (Metric): 1005; Height: 0.6mm; Lead Free: Lead Free; Case Code (Imperial): 0402; Forward Current: 20mA; Min Operating Temperature: -40°C
JP2 = Solder_Jumper: Solder Jumpers, open and closed
P1 = MHDR2X12: Header, 12-Pin, Dual row; LatestRevisionDate: 17-Jul-2002; LatestRevisionNote: Re-released for DXP Platform.; Publisher: Altium Limited
R8 R9 R13-R24 = CMP-2002-07472-1: as R31 on sheet TI_92_main
R10 = CMP-2002-08382-1: Manufacturer: Vishay Dale; Part Number: CRCW040222R0FKED
R11 R12 = CMP-2002-08382-1: Manufacturer: Vishay Dale; Part Number: CRCW040222R0FKED
TP10-TP24 = Test_Pad: Various Test Pads
U2 = CMP-06276-000039-1: IC MCU 8BIT 32KB FLASH 44VQFN; Oscillator Type: Internal; Interface: I2C; Core Architecture: PIC; Number of I/Os: 21; Peripherals: Brown-out Detect/Reset; Packaging: Rail/Tube; Memory Size: 32KB; Memory Type: FLASH; Case/Package: SOIC; Max Operating Temperature: 125°C; Min Operating Temperature: -40°C
Y2 = CMP-27762-000095-1: as Y3 on sheet TI_92_main; Width: 3.3mm; Frequency: 16MHz; Radiation Hardening: No; Height: 0.055inch; Tolerance: 20ppm; Length: 6mm; Case/Package: CSMD; Lead Free: Lead Free; Min Operating Temperature: -40°C; Termination: SMD/SMT; Operating Frequency: 16 MHz; Resistor Type: Ceramic; Packaging: Tape and Reel; Mount: Surface Mount; Load Capacitance: 18pF; Frequency Tolerance: 20ppm; Depth: 3.5mm; Series: ABM7; Package Quantity: 1000; Max Operating Temperature: 85°C; Number of Pins: 2

## Sheet TI_92_kbd_ND.SchDoc: Keyboard
size C; Organization: Altium Limited; Address1: L3, 12a Rodborough Rd; Address2: Frenchs Forest; Address3: NSW; Address4: Australia 2086; SheetNumber: 4
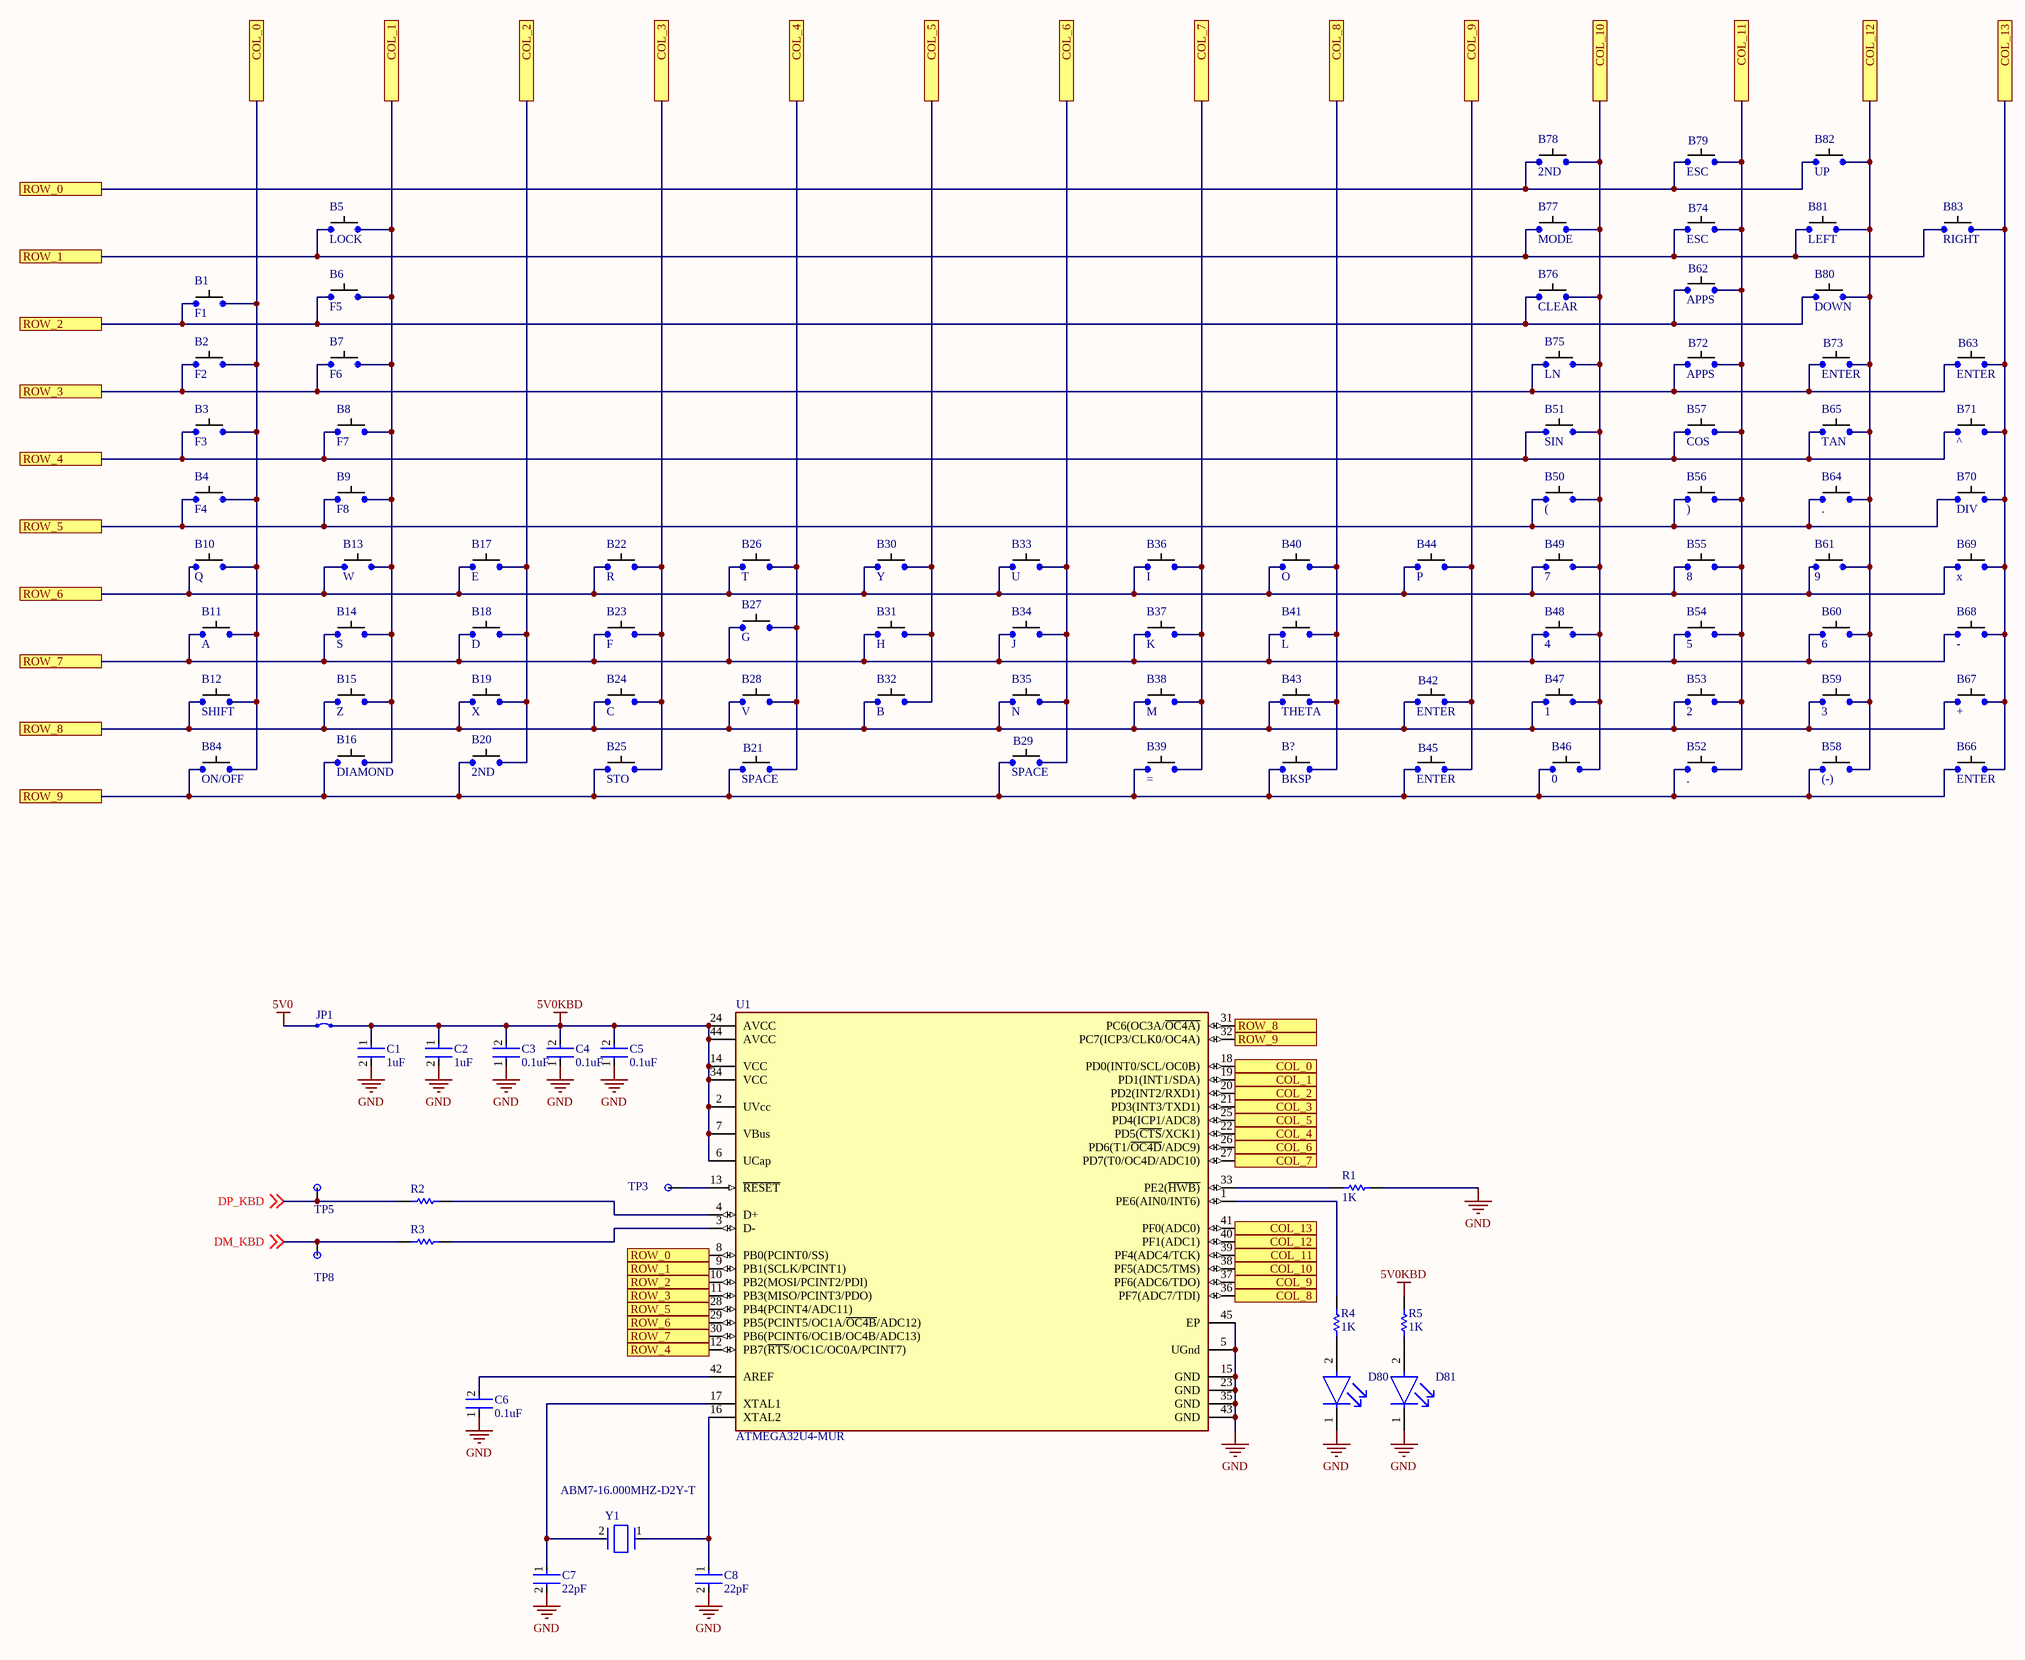
[diagram p3: TI_92_kbd_ND.SchDoc]

### Parts
B1  F1  [6mm_button_contacts]
B2  F2  [6mm_button_contacts]
B3  F3  [6mm_button_contacts]
B4  F4  [6mm_button_contacts]
B5  LOCK  [6mm_button_contacts]
B6  F5  [6mm_button_contacts]
B7  F6  [6mm_button_contacts]
B8  F7  [6mm_button_contacts]
B9  F8  [6mm_button_contacts]
B10  Q  [6mm_button_contacts]
B11  A  [6mm_button_contacts]
B12  SHIFT  [6mm_button_contacts]
B13  W  [6mm_button_contacts]
B14  S  [6mm_button_contacts]
B15  Z  [6mm_button_contacts]
B16  DIAMOND  [6mm_button_contacts]
B17  E  [6mm_button_contacts]
B18  D  [6mm_button_contacts]
B19  X  [6mm_button_contacts]
B20  2ND  [6mm_button_contacts]
B21  SPACE  [6mm_button_contacts]
B22  R  [6mm_button_contacts]
B23  F  [6mm_button_contacts]
B24  C  [6mm_button_contacts]
B25  STO  [6mm_button_contacts]
B26  T  [6mm_button_contacts]
B27  G  [6mm_button_contacts]
B28  V  [6mm_button_contacts]
B29  SPACE  [6mm_button_contacts]
B30  Y  [6mm_button_contacts]
B31  H  [6mm_button_contacts]
B32  B  [6mm_button_contacts]
B33  U  [6mm_button_contacts]
B34  J  [6mm_button_contacts]
B35  N  [6mm_button_contacts]
B36  I  [6mm_button_contacts]
B37  K  [6mm_button_contacts]
B38  M  [6mm_button_contacts]
B39  (no value)  [6mm_button_contacts]
B40  O  [6mm_button_contacts]
B41  L  [6mm_button_contacts]
B42  ENTER  [6mm_button_contacts]
B43  THETA  [6mm_button_contacts]
B44  P  [6mm_button_contacts]
B45  ENTER  [6mm_button_contacts]
B46  0  [6mm_button_contacts]
B47  1  [6mm_button_contacts]
B48  4  [6mm_button_contacts]
B49  7  [6mm_button_contacts]
B50  (  [6mm_button_contacts]
B51  SIN  [6mm_button_contacts]
B52  .  [6mm_button_contacts]
B53  2  [6mm_button_contacts]
B54  5  [6mm_button_contacts]
B55  8  [6mm_button_contacts]
B56  )  [6mm_button_contacts]
B57  COS  [6mm_button_contacts]
B58  (-)  [6mm_button_contacts]
B59  3  [6mm_button_contacts]
B60  6  [6mm_button_contacts]
B61  9  [6mm_button_contacts]
B62  APPS  [6mm_button_contacts]
B63  ENTER  [6mm_button_contacts]
B64  .  [6mm_button_contacts]
B65  TAN  [6mm_button_contacts]
B66  ENTER  [6mm_button_contacts]
B67  +  [6mm_button_contacts]
B68  -  [6mm_button_contacts]
B69  x  [6mm_button_contacts]
B70  DIV  [6mm_button_contacts]
B71  ^  [6mm_button_contacts]
B72  APPS  [6mm_button_contacts]
B73  ENTER  [6mm_button_contacts]
B74  ESC  [6mm_button_contacts]
B75  LN  [6mm_button_contacts]
B76  CLEAR  [6mm_button_contacts]
B77  MODE  [6mm_button_contacts]
B78  2ND  [6mm_button_contacts]
B79  ESC  [6mm_button_contacts]
B80  DOWN  [D_PAD_BUTTON]
B81  LEFT  [D_PAD_BUTTON]
B82  UP  [D_PAD_BUTTON]
B83  RIGHT  [D_PAD_BUTTON]
B84  ON/OFF  [6mm_button_contacts]
B?  BKSP  [6mm_button_contacts]
C1  1uF  [FP-C0402C105K8PACTU-MFG]
C2  1uF  [FP-C0402C105K8PACTU-MFG]
C3  0.1uF  [FP-GRM15-MFG]
C4  0.1uF  [FP-GRM15-MFG]
C5  0.1uF  [FP-GRM15-MFG]
C6  0.1uF  [FP-GRM15-MFG]
C7  22pF  [FP-C0402C105K8PACTU-MFG]
C8  22pF  [FP-C0402C105K8PACTU-MFG]
D80  APHHS1005CGCK  [FP-APHHS1005CGCK-MFG]  (value not drawn)
D81  APHHS1005CGCK  [FP-APHHS1005CGCK-MFG]  (value not drawn)
JP1  Solder Jumper  [SOLDER_JUMPER_CLOSED]  (value not drawn)
R1  1K  [RESC1005X40X25LL05T05]
R2  CRCW040222R0FKED  [RESC1005X40X25LL05T05]  (value not drawn)
R3  CRCW040222R0FKED  [RESC1005X40X25LL05T05]  (value not drawn)
R4  1K  [RESC1005X40X25NL05T10]
R5  1K  [RESC1005X40X25NL05T10]
TP3  Test Pad  [1.5MM_PAD]  (value not drawn)
TP5  Test Pad  [1.5MM_PAD]  (value not drawn)
TP8  Test Pad  [1.5MM_PAD]  (value not drawn)
U1  ATMEGA32U4-MUR  [FP-44PW-MFG]
Y1  ABM7-16.000MHZ-D2Y-T  [FP-ABM7-MFG]

### Ports
COL_0, COL_1, COL_2, COL_3, COL_4, COL_5, COL_6, COL_7, COL_8, COL_9, COL_10, COL_11, COL_12, COL_13, ROW_0, ROW_1, ROW_2, ROW_3, ROW_4, ROW_5, ROW_6, ROW_7, ROW_8, ROW_9

### Nets
5V0: JP1.1
5V0KBD: C1.1 C2.1 C3.2 C4.2 C5.2 JP1.2 R5.2 U1.2(UVcc) U1.6(UCap) U1.7(VBus) U1.14(VCC) U1.24(AVCC) U1.34(VCC) U1.44(AVCC)
GND: C1.2 C2.2 C3.1 C4.1 C5.1 C6.1 C7.2 C8.2 D80.1(C) D81.1(C) R1.2 U1.5(UGnd) U1.15(GND) U1.23(GND) U1.35(GND) U1.43(GND) U1.45(EP)
DM_KBD: R3.1 TP8.1(PAD) ; off-sheet DM_KBD
DP_KBD: R2.1 TP5.1(PAD) ; off-sheet DP_KBD
NetB1_1: B1.1 B2.1 B3.1 B4.1 B10.1 B11.1 B12.1 B84.1 U1.18(PD0(INT0/SCL/OC0B)) ; port COL_0
NetB1_2: B1.2 B6.2 B62.2 B76.2 B80.2 U1.10(PB2(MOSI/PCINT2/PDI)) ; port ROW_2
NetB2_2: B2.2 B7.2 B63.2 B72.2 B73.2 B75.2 U1.11(PB3(MISO/PCINT3/PDO)) ; port ROW_3
NetB3_2: B3.2 B8.2 B51.2 B57.2 B65.2 B71.2 U1.12(PB7(~{RTS}/OC1C/OC0A/PCINT7)) ; port ROW_4
NetB4_2: B4.2 B9.2 B50.2 B56.2 B64.2 B70.2 U1.28(PB4(PCINT4/ADC11)) ; port ROW_5
NetB5_1: B5.1 B6.1 B7.1 B8.1 B9.1 B13.1 B14.1 B15.1 B16.1 U1.19(PD1(INT1/SDA)) ; port COL_1
NetB5_2: B5.2 B74.2 B77.2 B81.2 B83.2 U1.9(PB1(SCLK/PCINT1)) ; port ROW_1
NetB10_2: B10.2 B13.2 B17.2 B22.2 B26.2 B30.2 B33.2 B36.2 B40.2 B44.2 B49.2 B55.2 B61.2 B69.2 U1.29(PB5(PCINT5/OC1A/~{OC4B}/ADC12)) ; port ROW_6
NetB11_2: B11.2 B14.2 B18.2 B23.2 B27.2 B31.2 B34.2 B37.2 B41.2 B48.2 B54.2 B60.2 B68.2 U1.30(PB6(PCINT6/OC1B/OC4B/ADC13)) ; port ROW_7
NetB12_2: B12.2 B15.2 B19.2 B24.2 B28.2 B32.2 B35.2 B38.2 B42.2 B43.2 B47.2 B53.2 B59.2 B67.2 U1.31(PC6(OC3A/~{OC4A)}) ; port ROW_8
NetB16_2: B16.2 B20.2 B21.2 B25.2 B29.2 B39.2 B45.2 B46.2 B52.2 B58.2 B66.2 B84.2 B?.2 U1.32(PC7(ICP3/CLK0/OC4A)) ; port ROW_9
NetB17_1: B17.1 B18.1 B19.1 B20.1 U1.20(PD2(INT2/RXD1)) ; port COL_2
NetB21_1: B21.1 B26.1 B27.1 B28.1 U1.22(PD5(~{CTS}/XCK1)) ; port COL_4
NetB22_1: B22.1 B23.1 B24.1 B25.1 U1.21(PD3(INT3/TXD1)) ; port COL_3
NetB29_1: B29.1 B33.1 B34.1 B35.1 U1.26(PD6(T1/~{OC4D}/ADC9)) ; port COL_6
NetB30_1: B30.1 B31.1 B32.1 U1.25(PD4(ICP1/ADC8)) ; port COL_5
NetB36_1: B36.1 B37.1 B38.1 B39.1 U1.27(PD7(T0/OC4D/ADC10)) ; port COL_7
NetB40_1: B40.1 B41.1 B43.1 B?.1 U1.36(PF7(ADC7/TDI)) ; port COL_8
NetB42_1: B42.1 B44.1 B45.1 U1.37(PF6(ADC6/TDO)) ; port COL_9
NetB46_1: B46.1 B47.1 B48.1 B49.1 B50.1 B51.1 B75.1 B76.1 B77.1 B78.1 U1.38(PF5(ADC5/TMS)) ; port COL_10
NetB52_1: B52.1 B53.1 B54.1 B55.1 B56.1 B57.1 B62.1 B72.1 B74.1 B79.1 U1.39(PF4(ADC4/TCK)) ; port COL_11
NetB58_1: B58.1 B59.1 B60.1 B61.1 B64.1 B65.1 B73.1 B80.1 B81.1 B82.1 U1.40(PF1(ADC1)) ; port COL_12
NetB63_1: B63.1 B66.1 B67.1 B68.1 B69.1 B70.1 B71.1 B83.1 U1.41(PF0(ADC0)) ; port COL_13
NetB78_2: B78.2 B79.2 B82.2 U1.8(PB0(PCINT0/SS)) ; port ROW_0
NetC6_2: C6.2 U1.42(AREF)
NetC7_1: C7.1 U1.17(XTAL1) Y1.2
NetC8_1: C8.1 U1.16(XTAL2) Y1.1
NetD80_2: D80.2(A) R4.1
NetD81_2: D81.2(A) R5.1
NetR1_1: R1.1 U1.33(PE2(~{HWB)})
NetR2_2: R2.2 U1.4(D+)
NetR3_2: R3.2 U1.3(D-)
NetR4_2: R4.2 U1.1(PE6(AIN0/INT6))
NetTP3_1: TP3.1(PAD) U1.13(~{RESET})

### Notes on the sheet
- Title
- Size:
- Date:
- File:
- C
- Number:
- Time:
- Revision:
- Sheet
- of

### Library data of the parts
B1-B84 B? = BUTTON: Contact pads to match TI-92 PCB patterns for carbon contact button
C1 C2 C7 C8 = CMP-2008-02081-2: as C30 on sheet TI_92_main; Number of Pins: 2; Contact Plating: Tin; Min Operating Temperature: -55°C; Termination: SMD/SMT; Lead Free: Lead Free; Construction: Flat; Voltage Rating (DC): 10V; Mount: Surface Mount; Series: C; Thickness: 0.022inch; Width: 0.5mm; Radiation Hardening: No; Capacitance: 1uF; Dielectric: X5R; Height: 0.5mm; Voltage: 10V; Length: 1mm; Depth: 0.5mm; Max Operating Temperature: 85°C; Package Quantity: 1; Packaging: Tape and Reel; RoHS Compliant: Yes; Case Code (Imperial): 0402; Case Code (Metric): 1005; REACH SVHC: No SVHC; Voltage Rating: 10V; Case/Package: 0402
C3-C6 = CMP-2100-03641-2: as C26 on sheet TI_92_main; RoHS: TRUE; Temperature Characteristic: X7R; Octopart: https://octopart.com/grm155r71c104ka88d-murata-196880; Digikey Description: CAP CER 0.1UF 16V X7R 0402; Device Class L3: Ceramic Capacitors; Height: 0.55mm; ComponentLink2Description: Datasheet; Temperature Range Low: -55°C; Ipc Land Pattern Name: CAPC10050X219; ComponentLink2URL: https://search.murata.co.jp/Ceramy/image/img/A01X/G101/ENG/GRM155R71H471KA01-01A.pdf; Device Class L1: Passive Components; Lead Free: yes; Category: Cap; Package: GRM15; Temperature: -55°C to +125°C; Device Class L2: Capacitors; Temperature Range High: +125°C; Mouser Description: 0402 0.1 uF 16V ±10 % Tolerance X7R SMT Multilayer Ceramic Capacitor
D80 D81 = CMP-44529-000044-1: as D97 on sheet TI_92_main; Lens Color: Clear; Packaging: Tape and Reel; Max Operating Temperature: 85°C; Illumination Color: Green; Length: 1mm; Mount: Surface Mount; Lens Style: Clear; Color: Green; Number of Pins: 2; Wavelength: 570nm; Case/Package: 0402; Width: 0.5mm; Package Quantity: 2000; Case Code (Metric): 1005; Height: 0.6mm; Lead Free: Lead Free; Case Code (Imperial): 0402; Forward Current: 20mA; Min Operating Temperature: -40°C
JP1 = Solder_Jumper: Solder Jumpers, open and closed
R1 = CMP-2002-08382-1: as R10 on sheet TI_92_adc
R2 R3 = CMP-2002-08382-1: Manufacturer: Vishay Dale; Part Number: CRCW040222R0FKED
R4 R5 = CMP-2002-07472-1: as R31 on sheet TI_92_main
TP3 TP5 TP8 = Test_Pad: Various Test Pads
U1 = CMP-06276-000039-1: as U2 on sheet TI_92_adc; Packaging: Rail/Tube; Memory Size: 32KB; Memory Type: FLASH; Case/Package: SOIC; Max Operating Temperature: 125°C; Min Operating Temperature: -40°C
Y1 = CMP-27762-000095-1: as Y3 on sheet TI_92_main; Width: 3.3mm; Frequency: 16MHz; Radiation Hardening: No; Height: 0.055inch; Tolerance: 20ppm; Length: 6mm; Case/Package: CSMD; Lead Free: Lead Free; Min Operating Temperature: -40°C; Termination: SMD/SMT; Operating Frequency: 16 MHz; Resistor Type: Ceramic; Packaging: Tape and Reel; Mount: Surface Mount; Load Capacitance: 18pF; Frequency Tolerance: 20ppm; Depth: 3.5mm; Series: ABM7; Package Quantity: 1000; Max Operating Temperature: 85°C; Number of Pins: 2

## Nets that join several sheets
5V0: TI_92_main (C25.1 C26.2 U4.1), TI_92_power (9 pins), TI_92_adc (JP2.1), TI_92_kbd_ND (JP1.1)
GND: TI_92_main (21 pins), TI_92_power (24 pins), TI_92_adc (41 pins), TI_92_kbd_ND (17 pins)
DM_ADC: TI_92_main (U3.3), TI_92_adc (R12.1 TP21.1)
DM_KBD: TI_92_main (U3.1), TI_92_kbd_ND (R3.1 TP8.1)
DP_ADC: TI_92_main (U3.4), TI_92_adc (R11.1 TP18.1)
DP_KBD: TI_92_main (U3.2), TI_92_kbd_ND (R2.1 TP5.1)